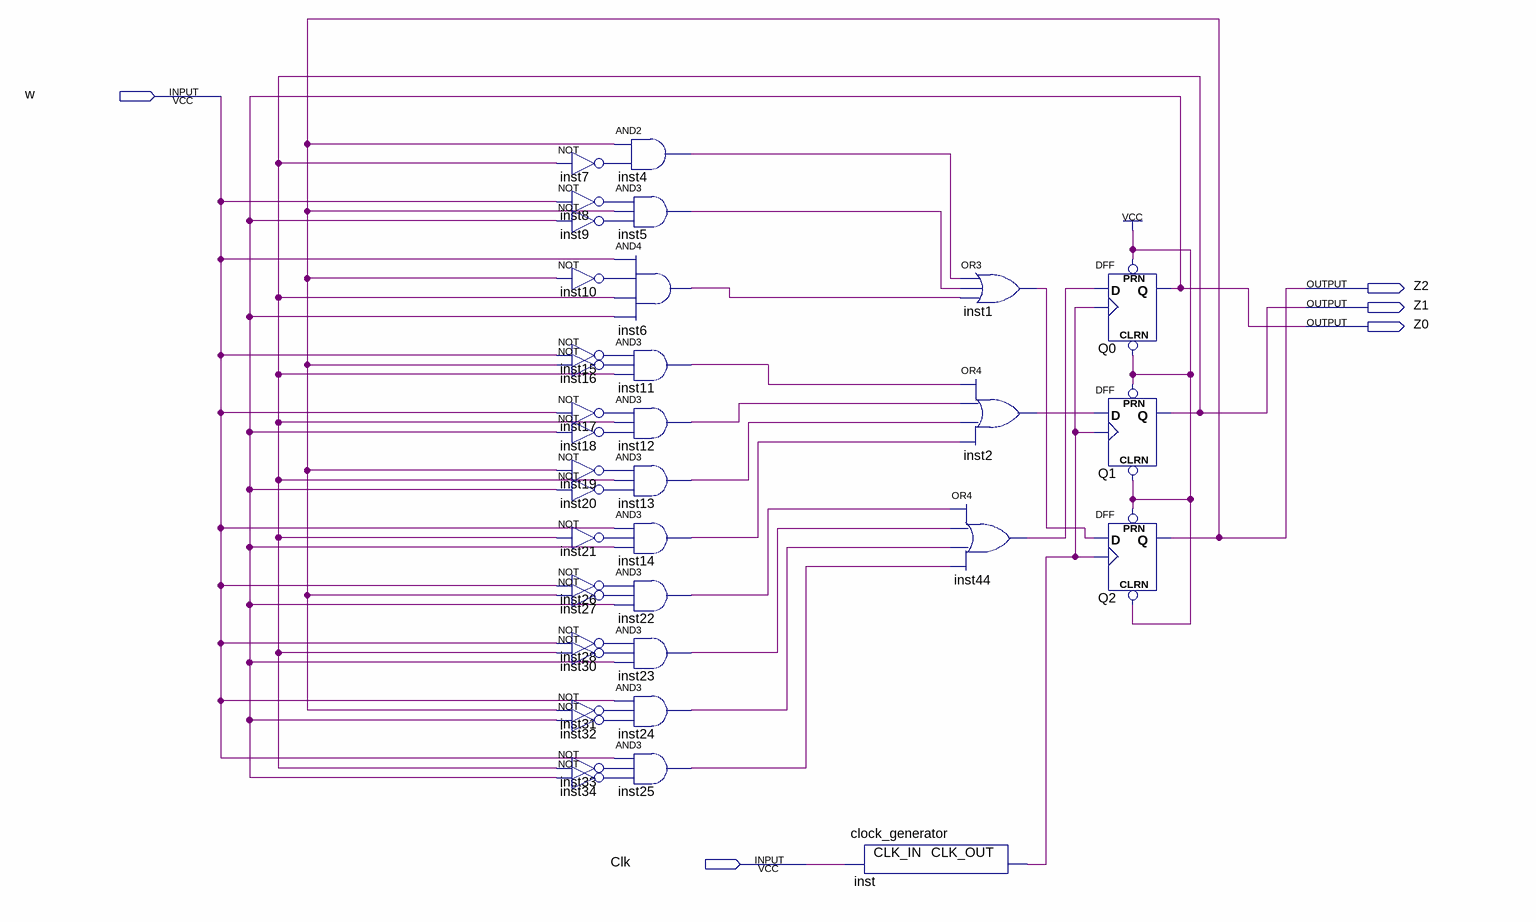
[diagram p0: schematic sheet]
// Quartus schematic counter.bdf as structural Verilog: 37 symbols, 5 pins
module counter (
  input  w,
  input  Clk,
  output Z2,
  output Z1,
  output Z0
);

  wire inst1_out, inst2_out, inst4_out, inst5_out, inst6_out, inst7_out, inst8_out, inst9_out, inst10_out,
       inst11_out, inst12_out, inst13_out, inst14_out, inst15_out, inst16_out, inst17_out, inst18_out,
       inst19_out, inst20_out, inst21_out, inst22_out, inst23_out, inst24_out, inst25_out, inst26_out,
       inst27_out, inst28_out, inst30_out, inst31_out, inst32_out, inst33_out, inst34_out, inst44_out,
       inst_clk_out;

  and inst4 (inst4_out, Z2, inst7_out);
  not inst7 (inst7_out, Z1);
  and inst5 (inst5_out, inst8_out, Z2, inst9_out);
  not inst8 (inst8_out, w);
  not inst9 (inst9_out, Z0);
  and inst6 (inst6_out, w, inst10_out, Z1, Z0);
  not inst10 (inst10_out, Z2);
  and inst11 (inst11_out, inst15_out, inst16_out, Z1);
  not inst15 (inst15_out, w);
  not inst16 (inst16_out, Z2);
  and inst12 (inst12_out, inst17_out, Z1, inst18_out);
  not inst17 (inst17_out, w);
  not inst18 (inst18_out, Z0);
  and inst13 (inst13_out, inst19_out, Z1, inst20_out);
  not inst19 (inst19_out, Z2);
  not inst20 (inst20_out, Z0);
  and inst14 (inst14_out, w, inst21_out, Z0);
  not inst21 (inst21_out, Z1);
  and inst22 (inst22_out, inst26_out, inst27_out, Z0);
  not inst26 (inst26_out, w);
  not inst27 (inst27_out, Z2);
  and inst23 (inst23_out, inst28_out, inst30_out, Z0);
  not inst28 (inst28_out, w);
  not inst30 (inst30_out, Z1);
  and inst24 (inst24_out, w, inst31_out, inst32_out);
  not inst31 (inst31_out, Z2);
  not inst32 (inst32_out, Z0);
  and inst25 (inst25_out, w, inst33_out, inst34_out);
  not inst33 (inst33_out, Z1);
  not inst34 (inst34_out, Z0);
  clock_generator inst (.CLK_IN(Clk), .CLK_OUT(inst_clk_out));
  or inst1 (inst1_out, inst4_out, inst5_out, inst6_out);
  or inst2 (inst2_out, inst11_out, inst12_out, inst13_out, inst14_out);
  or inst44 (inst44_out, inst22_out, inst23_out, inst24_out, inst25_out);
  DFF Q0 (.CLRN(1'b1), .CLK(inst_clk_out), .D(inst44_out), .PRN(1'b1), .Q(Z0));
  DFF Q1 (.CLRN(1'b1), .CLK(inst_clk_out), .D(inst2_out), .PRN(1'b1), .Q(Z1));
  DFF Q2 (.CLRN(1'b1), .CLK(inst_clk_out), .D(inst1_out), .PRN(1'b1), .Q(Z2));
endmodule
